# EAGLE schematic 701_breakout_serial (EAGLE 7.4.0)
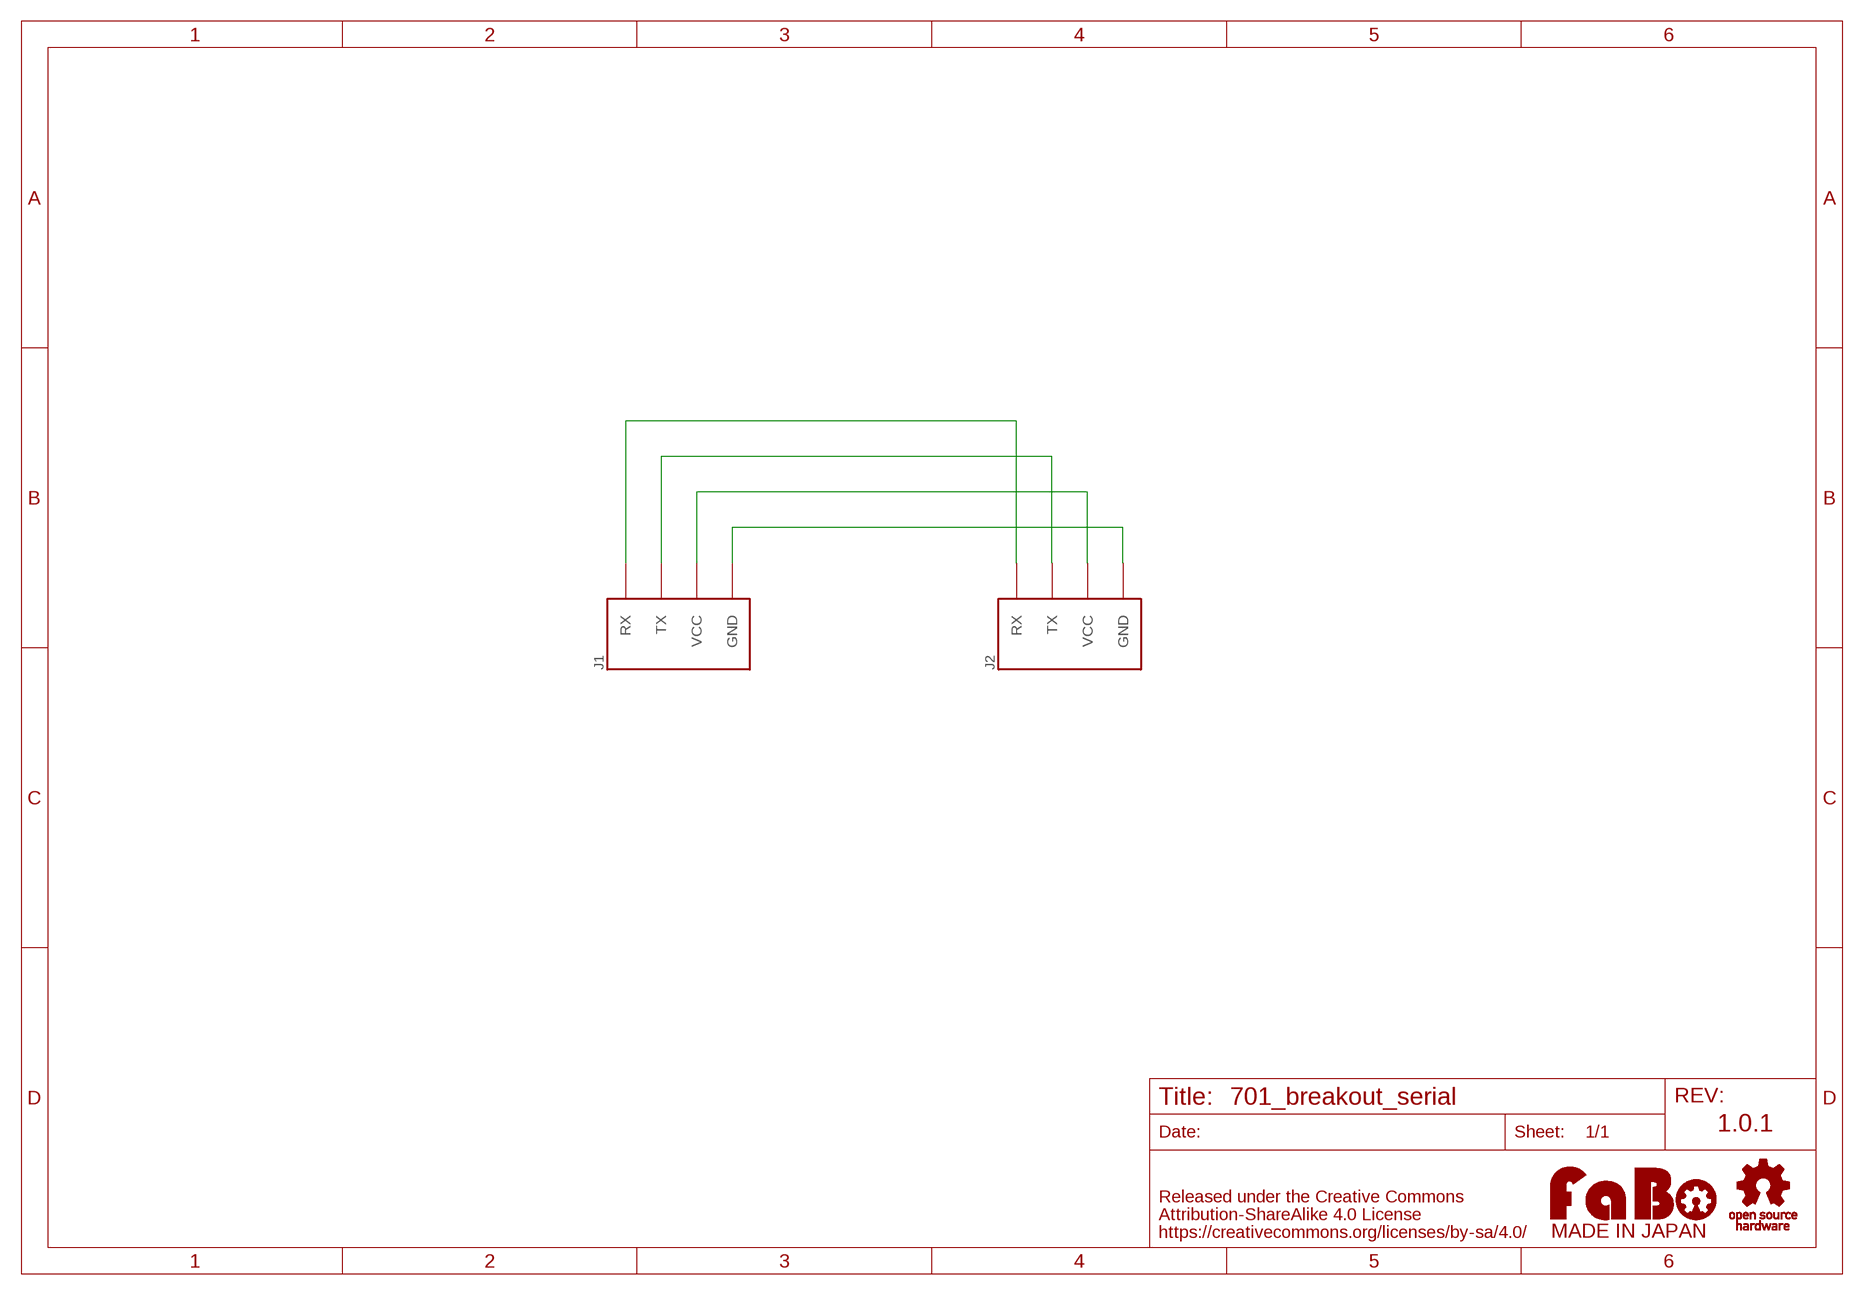
[diagram p0: schematic, sheet 1]

## Parts
J1  FABO_BRICK_SERIAL-BREAKOUT  [FABO_BRICK_SERIAL_BREAKOUT]
J2  FABO_BRICK_SERIAL-CONNECTOR  [FABO_BRICK_SERIAL_CONNECTOR]
U$2  LOGO_FABO-M_BOTTOM  [LOGO_FABO_MS_BOTTOM]
U$3  LOGO_OSHW-S_BOTTOM  [LOGO_OSHW_S_BOTTOM]

## Nets
GND: J1.GND J2.GND
SCL: J1.RX J2.RX
SDA: J1.TX J2.TX
VCC: J1.VCC J2.VCC

## Notes on the sheet
- 1.0.1

## Library data of the parts
J1 J2 = FaBo-Template:FABO_BRICK_SERIAL: FaBo Brick Serial
U$2 = FaBo-etc:LOGO_FABO
U$3 = FaBo-etc:LOGO_OSHW